# Altium project CHARGER_BOARD.PrjPCB
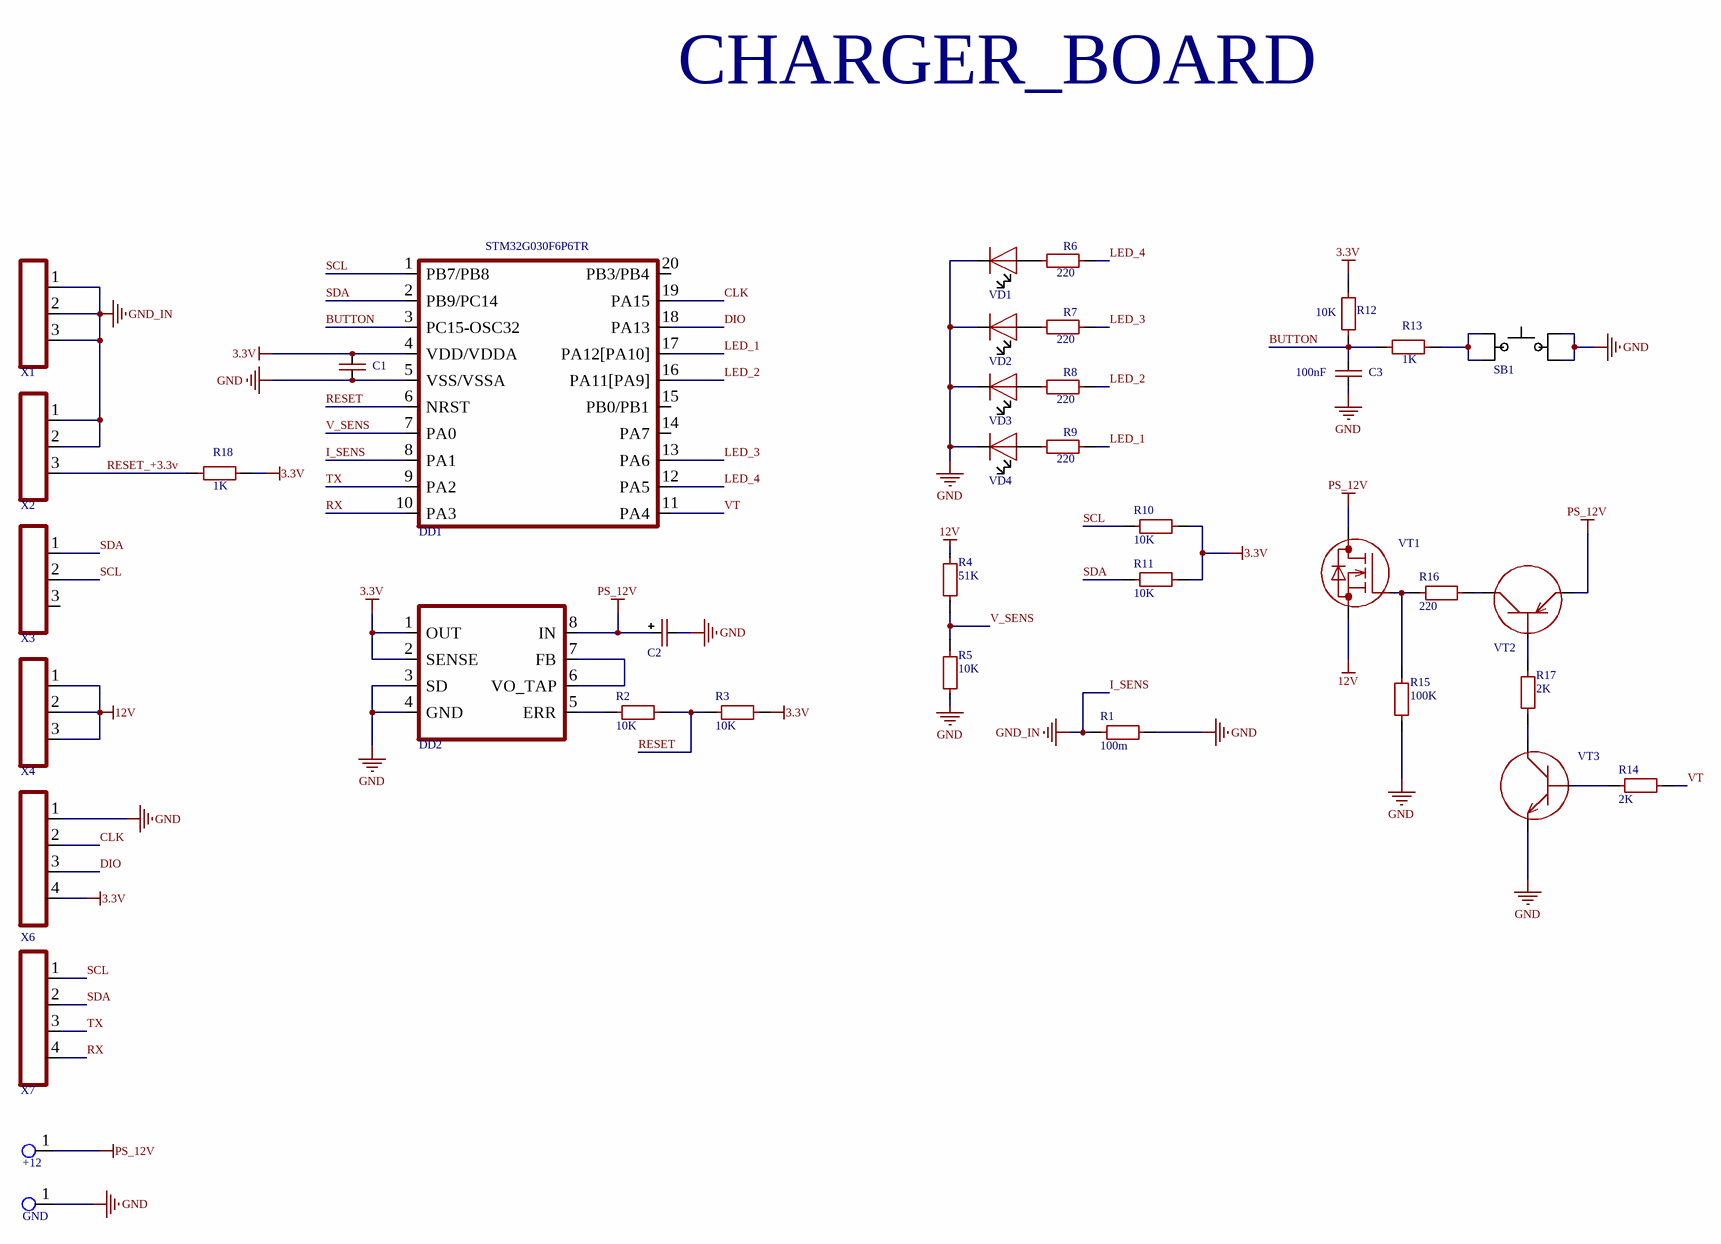
[diagram p0: CHARGER_BOARD.SchDoc]
1 sheet, 39 parts. Net scope: global (net labels, ports and power ports of the same name join across sheets).
Board file: CHARGER_BOARD.PcbDoc

## Sheet CHARGER_BOARD.SchDoc
size A1

### Parts
+12  Test_Point_PCB  [Point]  (value not drawn)
C1  CAP-NON-POLAR  [CAP-0603]  (value not drawn)
C2  CAP-POLAR  [CAP-TAN-C]  (value not drawn)
C3  100nF  [CAP-0603]
DD1  STM32G030F6P6TR  [TSSOP-20]
DD2  LP2951  [SO8-150]  (value not drawn)
GND  Test_Point_PCB  [Point]  (value not drawn)
R1  100m  [RES-2512]
R2  10K  [RES-0603]
R3  10K  [RES-0603]
R4  51K  [RES-0603]
R5  10K  [RES-0603]
R6  220  [RES-0603]
R7  220  [RES-0603]
R8  220  [RES-0603]
R9  220  [RES-0603]
R10  10K  [RES-0603]
R11  10K  [RES-0603]
R12  10K  [RES-0603]
R13  1K  [RES-0603]
R14  2K  [RES-0603]
R15  100K  [RES-0603]
R16  220  [RES-0603]
R17  2K  [RES-0603]
R18  1K  [RES-0603]
SB1  BUTTON-TACT-4PIN  [TACTB-6x6 SMD]  (value not drawn)
VD1  LED  [LED-0603]  (value not drawn)
VD2  LED  [LED-0603]  (value not drawn)
VD3  LED  [LED-0603]  (value not drawn)
VD4  LED  [LED-0603]  (value not drawn)
VT1  MOSFET-N-GDS  [TO252]  (value not drawn)
VT2  BC857-BEC  [SOT23-3]  (value not drawn)
VT3  BC847-BEC  [SOT23-3]  (value not drawn)
X1  CONN-3-PIN  [4-SMD]  (value not drawn)
X2  CONN-3-PIN  [4-SMD]  (value not drawn)
X3  CONN-3-PIN  [4-SMD]  (value not drawn)
X4  CONN-3-PIN  [4-SMD]  (value not drawn)
X6  CONN-4-PIN  [CONN-PLS-4-2.54mm]  (value not drawn)
X7  CONN-4-PIN  [CONN-PLS-4-2.54mm]  (value not drawn)

### Nets
3.3V: C1.2 DD1.4(VDD/VDDA) DD2.1(OUT) DD2.2(SENSE) R3.1 R10.1 R11.1 R12.2 R18.2 X6.4
12V: R4.1 VT1.3(S) X4.1 X4.2 X4.3
GND: C1.1 C2.2(-) C3.1 DD1.5(VSS/VSSA) DD2.3(SD) DD2.4(GND) GND.1(G9) R1.2 R5.2 R15.1 SB1.3 SB1.4 VD1.1(C) VD2.1(C) VD3.1(C) VD4.1(C) VT3.2(E) X6.1
I_SENS: DD1.8(PA1) R1.1 X1.1 X1.2 X1.3 X2.1 X2.2  [also labelled GND_IN]
PS_12V: +12.1(G9) C2.1(+) DD2.8(IN) VT1.2(D) VT2.2(E)
BUTTON: C3.2 DD1.3(PC15-OSC32) R12.1 R13.1
CLK: DD1.19(PA15) X6.2
DIO: DD1.18(PA13) X6.3
LED_1: DD1.17(PA12[PA10]) R9.2
LED_2: DD1.16(PA11[PA9]) R8.2
LED_3: DD1.13(PA6) R7.2
LED_4: DD1.12(PA5) R6.2
RESET: DD1.6(NRST) R2.1 R3.2
RESET_+3.3v: R18.1 X2.3
RX: DD1.10(PA3) X7.4
SCL: DD1.1(PB7/PB8) R10.2 X3.2 X7.1
SDA: DD1.2(PB9/PC14) R11.2 X3.1 X7.2
TX: DD1.9(PA2) X7.3
V_SENS: DD1.7(PA0) R4.2 R5.1
VT: DD1.11(PA4) R14.1
NetDD2_5: DD2.5(ERR) R2.2
NetDD2_6: DD2.6(VO_TAP) DD2.7(FB)
NetR6_1: R6.1 VD1.2(A)
NetR7_1: R7.1 VD2.2(A)
NetR8_1: R8.1 VD3.2(A)
NetR9_1: R9.1 VD4.2(A)
NetR13_2: R13.2 SB1.1 SB1.2
NetR14_2: R14.2 VT3.1(B)
NetR15_2: R15.2 R16.1 VT1.1(G)
NetR16_2: R16.2 VT2.3(C)
NetR17_1: R17.1 VT2.1(B)
NetR17_2: R17.2 VT3.3(C)

Not connected (* = marked no-connect by the designer): DD1 14(PA7) 15(PB0/PB1) 20(PB3/PB4); X3 3

### Notes on the sheet
- CHARGER_BOARD

### Library data of the parts
+12 GND = POINT
C3 = CAP-NON-POLAR
R1-R18 = RES-CONST